# Altium schematic sheet Лист 1.SchDoc
size 420 x 297 mm; Address1: Address1; Address2: Address2; Address3: Address3; Address4: Address4; DocumentNumber: АБВГ.123456.001 Э3; SheetNumber: 1; Scale: 1:1; DocumentType: Схема электрическая принципиальная; FirstReferrence: АБВГ.123456.001; Разраб.: Иванов; Обозначение документа: АБВГ.123456.001 Э3; Пров.: Петров; Утв.: Сидоров; Номер листа: 1; Общее количество листов: 1; Масштаб: 1:1; Наименование организации: ОАО "Ваша фирма"; Перв. применение: АБВГ.123456.000; Наименование изделия 3: Схема электрическая принципиальная; Нач. отд.: Нач. отд.; Фамилия нач. отд.: Сидоров
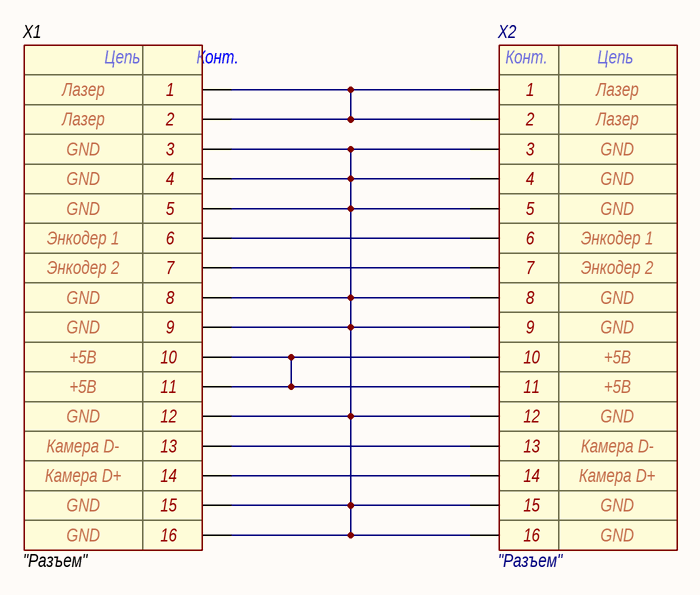
[diagram p0: Лист 1.SchDoc]

## Parts
X1  CommentText: "Разъем"  [CON: IDC-16MS]
X2  "Разъем"  [CON: 52207-1633, FFC / FPC]

## Nets
NetX1_1: X1.1 X1.2 X2.1 X2.2
NetX1_3: X1.3 X1.4 X1.5 X1.8 X1.9 X1.12 X1.15 X1.16 X2.3 X2.4 X2.5 X2.8 X2.9 X2.12 X2.15 X2.16
NetX1_6: X1.6 X2.6
NetX1_7: X1.7 X2.7
NetX1_10: X1.10 X1.11 X2.10 X2.11
NetX1_13: X1.13 X2.13
NetX1_14: X1.14 X2.14

## Notes on the sheet
- Перв. примен.
- Справ. №
- Подп. и дата
- Инв. № дубл.
- Взам. инв. №
- Разраб.
- Изм.
- Лист
- № докум.
- Подп.
- Дата
- Лит.
- Масса
- Масштаб
- Пров.
- Т.контр.
- Листов
- Инв. № подл.
- Утв.
- Н.контр.
- Копировал
- Формат А3
- (in symbol 52207-1633, FFC / FPC) Конт.; Цепь
- (in symbol IDC-16) Цепь; Конт.

## Library data of the parts
X1 = IDC-16: Manufacturer: Connfly; ValueManufacturerPartNumber: Connector, 16pin, 2.54mm, 250VAC, 3A; TypeConnector: Connector; VoltageMax: 250VAC; Pitch: 2.54mm; CurrentMax: 3A; Multichannel: 16pin; Pin_1: Лазер; Pin_3: GND; Pin_6: Энкодер 1; Pin_7: Энкодер 2; Pin_10: +5В; Pin_13: Камера D-; Pin_14: Камера D+; HelpURL: https://www.chipdip.ru/product/idc-16ms; PartNumber: IDC-16; Pin_2: Лазер; Pin_4: GND; Pin_5: GND; Pin_8: GND; Pin_9: GND; Pin_11: +5В; Pin_12: GND; Pin_15: GND; Pin_16: GND
X2 = 52207-1633, FFC / FPC: Pin_1: Лазер; Pin_3: GND; Pin_6: Энкодер 1; Pin_7: Энкодер 2; Pin_10: +5В; Pin_13: Камера D-; Pin_14: Камера D+; Pin_2: Лазер; Pin_4: GND; Pin_5: GND; Pin_8: GND; Pin_9: GND; Pin_11: +5В; Pin_12: GND; Pin_15: GND; Pin_16: GND